# EAGLE schematic CntrlBoardV2_0 (EAGLE 7.7.0)

## Sheet 1 of 9: µC and Programming
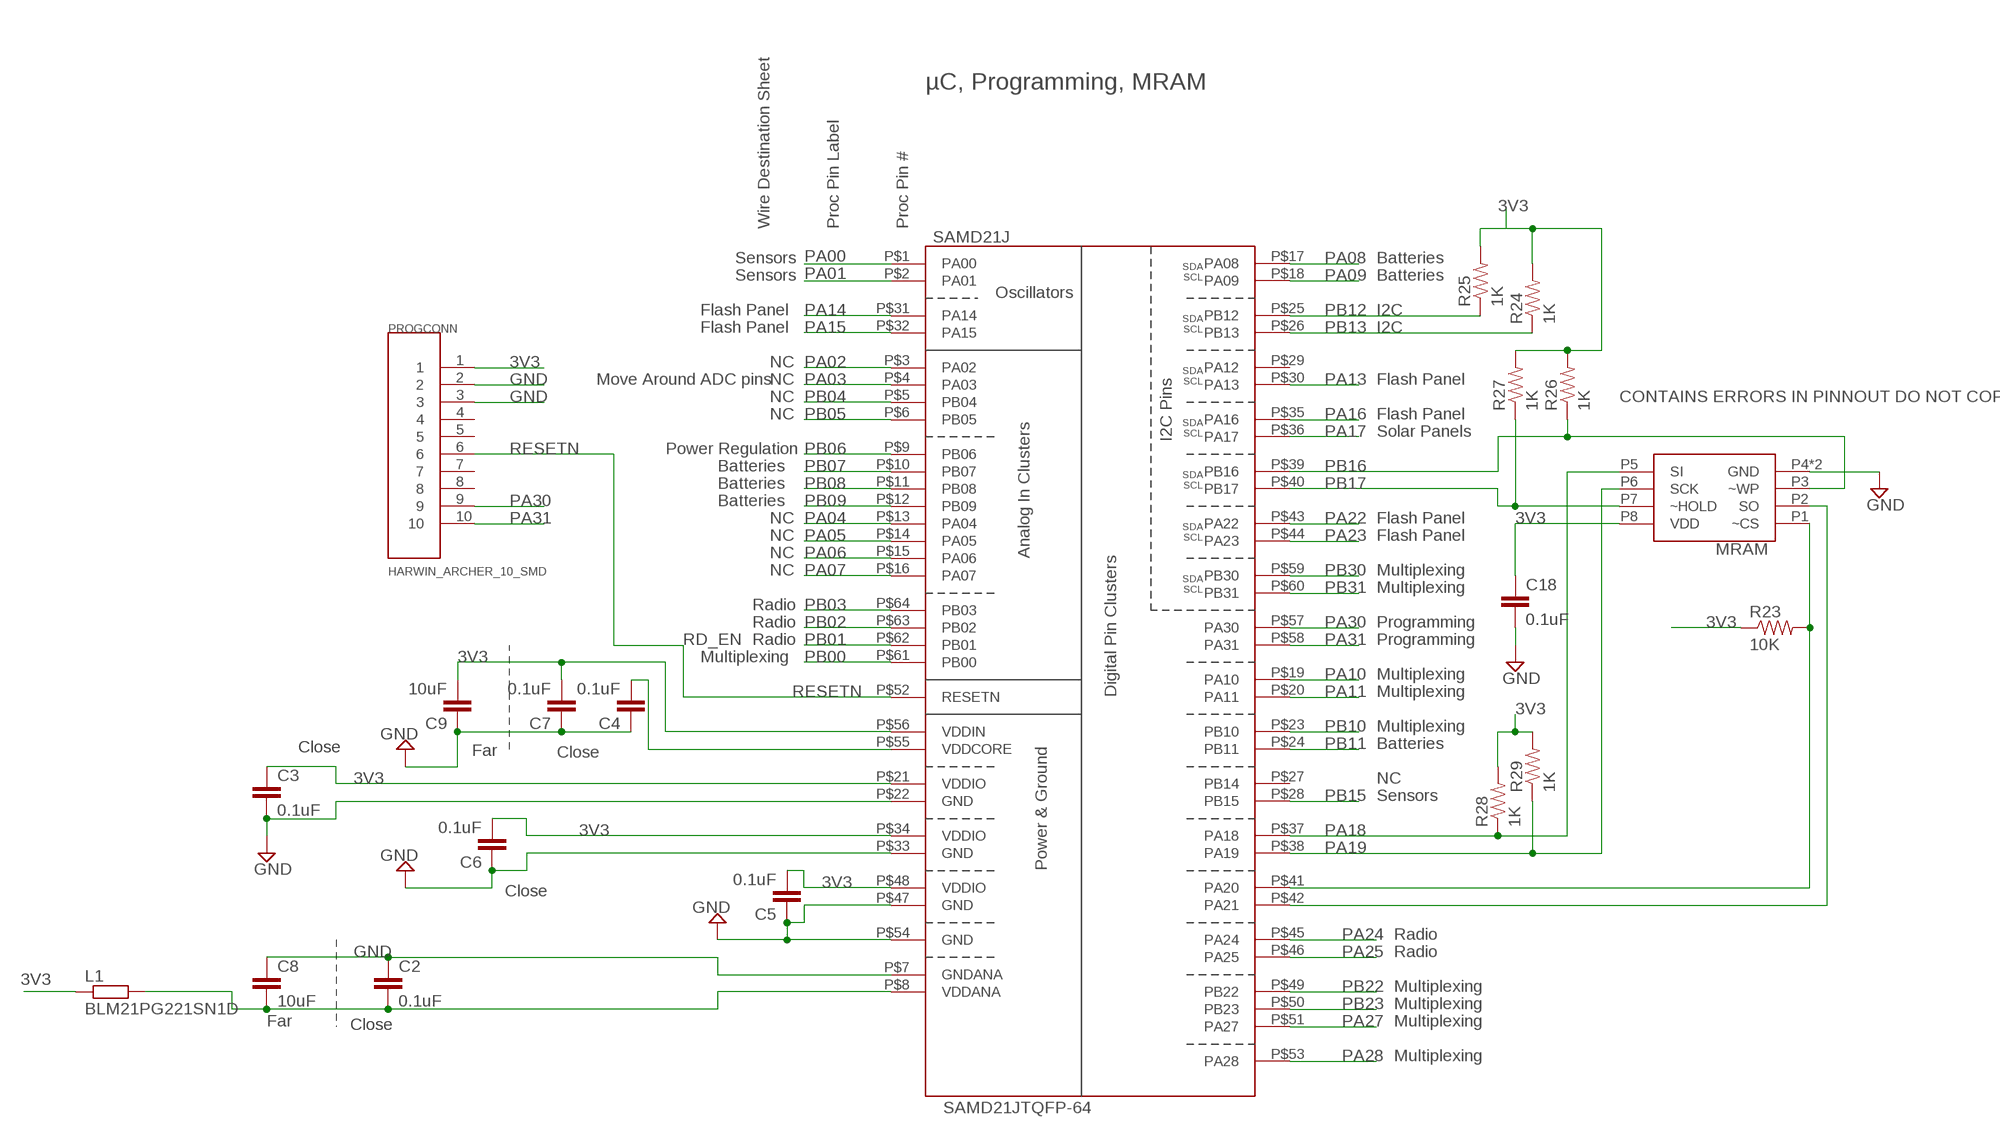
[diagram p0: schematic, sheet 1]

### Parts
C2  0.1uF  CAP0805  [0805]
C3  0.1uF  CAP0805  [0805]
C4  0.1uF  CAP0805  [0805]
C5  0.1uF  CAP0805  [0805]
C6  0.1uF  CAP0805  [0805]
C7  0.1uF  CAP0805  [0805]
C8  10uF  CAP0805  [0805]
C9  10uF  CAP0805  [0805]
C18  0.1uF  CAP0805  [0805]
L1  BLM21PG221SN1D  R-EU_R0805  [R0805]
MRAM  MR25H10CDC  [8PXMO-229]
PROGCONN  HARWIN_ARCHER_10_SMD  [HARWIN_ARCHER_10_SMD]
R23  10K  RESISTOR  [0805]
R24  1K  RESISTOR  [0805]
R25  1K  RESISTOR  [0805]
R26  1K  RESISTOR  [0805]
R27  1K  RESISTOR  [0805]
R28  1K  RESISTOR  [0805]
R29  1K  RESISTOR  [0805]
SAMD21J  SAMD21JTQFP-64  [TQFP-64]

### Nets
3V3 [3V3]: C3.1 C5.2 C6.2 C7.2 C9.2 C18.1 L1.1 MRAM.P8(VDD) PROGCONN.1 R23.1 R24.2 R25.2 R26.2 R27.2 R28.2 R29.2 SAMD21J.P$21(VDDIO) SAMD21J.P$34(VDDIO) SAMD21J.P$48(VDDIO) SAMD21J.P$56(VDDIN) ; also sheet 2,3,4,5,6,7,8
GND [GND]: C2.1 C3.2 C4.1 C5.1 C6.1 C7.1 C8.1 C9.1 C18.2 MRAM.P4(GND) MRAM.P9(GND) PROGCONN.2 PROGCONN.3 SAMD21J.P$7(GNDANA) SAMD21J.P$22(GND) SAMD21J.P$33(GND) SAMD21J.P$47(GND) SAMD21J.P$54(GND) ; also sheet 2,3,4,5,6,7,8,9
N$16: MRAM.P1(~CS) R23.2 SAMD21J.P$41(PA20)
N$18: MRAM.P2(SO) SAMD21J.P$42(PA21)
N$43: C2.2 C8.2 L1.2 SAMD21J.P$8(VDDANA)
N$44: C4.2 SAMD21J.P$55(VDDCORE)
PA00: SAMD21J.P$1(PA00) ; also sheet 3
PA01: SAMD21J.P$2(PA01)
PA02: SAMD21J.P$3(PA02)
PA03: SAMD21J.P$4(PA03)
PA04: SAMD21J.P$13(PA04)
PA05: SAMD21J.P$14(PA05)
PA06: SAMD21J.P$15(PA06)
PA07: SAMD21J.P$16(PA07)
PA08: SAMD21J.P$17(PA08) ; also sheet 5
PA09: SAMD21J.P$18(PA09) ; also sheet 5
PA10: SAMD21J.P$19(PA10) ; also sheet 7
PA11: SAMD21J.P$20(PA11) ; also sheet 7
PA13: SAMD21J.P$30(PA13) ; also sheet 8
PA14: SAMD21J.P$31(PA14) ; also sheet 8
PA15: SAMD21J.P$32(PA15) ; also sheet 8
PA16: SAMD21J.P$35(PA16) ; also sheet 8
PA17: SAMD21J.P$36(PA17) ; also sheet 6,9
PA18: MRAM.P5(SI) R28.1 SAMD21J.P$37(PA18)
PA19: MRAM.P6(SCK) R29.1 SAMD21J.P$38(PA19)
PA22: SAMD21J.P$43(PA22) ; also sheet 8
PA23: SAMD21J.P$44(PA23) ; also sheet 8
PA24: SAMD21J.P$45(PA24) ; also sheet 4
PA25: SAMD21J.P$46(PA25) ; also sheet 4
PA27: SAMD21J.P$51(PA27) ; also sheet 7
PA28: SAMD21J.P$53(PA28) ; also sheet 7
PA30: PROGCONN.9 SAMD21J.P$57(PA30) ; also sheet 9
PA31: PROGCONN.10 SAMD21J.P$58(PA31) ; also sheet 9
PB00: SAMD21J.P$61(PB00) ; also sheet 7
PB01: SAMD21J.P$62(PB01) ; also sheet 4
PB02: SAMD21J.P$63(PB02) ; also sheet 4
PB03: SAMD21J.P$64(PB03) ; also sheet 4
PB04: SAMD21J.P$5(PB04)
PB05: SAMD21J.P$6(PB05)
PB06: SAMD21J.P$9(PB06) ; also sheet 2
PB07: SAMD21J.P$10(PB07)
PB08: SAMD21J.P$11(PB08)
PB09: SAMD21J.P$12(PB09)
PB10: SAMD21J.P$23(PB10) ; also sheet 7
PB11: SAMD21J.P$24(PB11) ; also sheet 5
PB12: R25.1 SAMD21J.P$25(PB12) ; also sheet 3,6,8
PB13: R24.1 SAMD21J.P$26(PB13) ; also sheet 3,6,8
PB15: SAMD21J.P$28(PB15)
PB16: MRAM.P3(~WP) R26.1 SAMD21J.P$39(PB16)
PB17: MRAM.P7(~HOLD) R27.1 SAMD21J.P$40(PB17)
PB22: SAMD21J.P$49(PB22) ; also sheet 7
PB23: SAMD21J.P$50(PB23) ; also sheet 7
PB30: SAMD21J.P$59(PB30) ; also sheet 7
PB31: SAMD21J.P$60(PB31) ; also sheet 7
RESETN: PROGCONN.6 SAMD21J.P$52(RESETN) ; also sheet 9
Unconnected: PROGCONN.4 PROGCONN.5 PROGCONN.7 PROGCONN.8 SAMD21J.P$27(PB14) SAMD21J.P$29(PA12)

### Notes on the sheet
- µC, Programming, MRAM
- Wire Destination Sheet | Proc Pin Label | Proc Pin #
- Sensors | Batteries
- Sensors | Batteries
- Flash Panel | I2C
- Flash Panel | I2C
- NC
- Move Around ADC pins | NC | Flash Panel
- NC | CONTAINS ERRORS IN PINNOUT DO NOT COPY
- NC | Flash Panel
- Solar Panels
- Power Regulation
- Batteries
- Batteries
- Batteries
- NC | Flash Panel
- NC | Flash Panel
- NC
- NC | Multiplexing
- Multiplexing
- Radio
- Radio | Programming
- RD_EN | Radio | Programming
- Multiplexing
- Multiplexing
- Multiplexing
- Multiplexing
- Far | Close
- Close | Batteries
- NC
- Sensors
- Close
- Radio
- Radio
- Multiplexing
- Multiplexing
- Far | Close | Multiplexing
- Multiplexing

## Sheet 2 of 9: Power Regulation
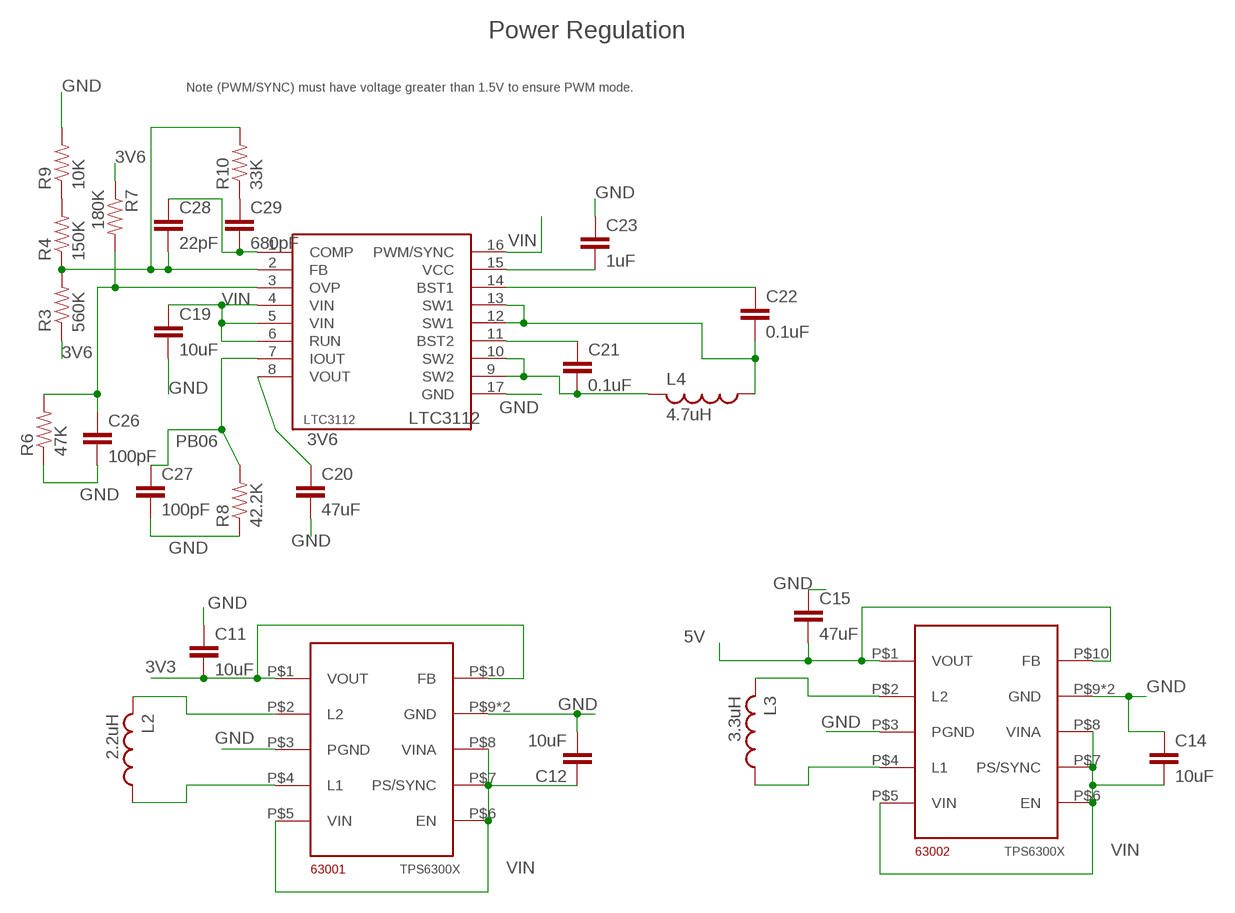
[diagram p1: schematic, sheet 2]

### Parts
63001  TPS6300X  [QFN10_POWERPAD]
63002  TPS6300X  [QFN10_POWERPAD]
C11  10uF  CAP0603-CAP  [0603-CAP]
C12  10uF  CAP0603-CAP  [0603-CAP]
C14  10uF  CAP0603-CAP  [0603-CAP]
C15  47uF  CAP0603-CAP  [0603-CAP]
C19  10uF  CAP0603-CAP  [0603-CAP]
C20  47uF  CAP0805  [0805]
C21  0.1uF  CAP0603-CAP  [0603-CAP]
C22  0.1uF  CAP0603-CAP  [0603-CAP]
C23  1uF  CAP0603-CAP  [0603-CAP]
C26  100pF  CAP0805  [0805]
C27  100pF  CAP0805  [0805]
C28  22pF  CAP0805  [0805]
C29  680pF  CAP0805  [0805]
L2  2.2uH  L-USL3225M  [L3225M]
L3  3.3uH  L-USL3225M  [L3225M]
L4  4.7uH  L-USL3225M  [L3225M]
LTC3112  LTC3112  [DHD16]
R3  560K  RESISTOR  [0805]
R4  150K  RESISTOR  [0805]
R6  47K  RESISTOR  [0805]
R7  180K  RESISTOR  [0805]
R8  42.2K  RESISTOR  [0805]
R9  10K  RESISTOR  [0805]
R10  33K  RESISTOR  [0805]

### Nets
3V3 [3V3]: 63001.P$1(VOUT) 63001.P$10(FB) C11.2 ; also sheet 1,3,4,5,6,7,8
3V6 [3V6]: C20.1 LTC3112.8(VOUT) R3.1 R7.1 ; also sheet 4
5V [5V]: 63002.P$1(VOUT) 63002.P$10(FB) C15.2 ; also sheet 3,5,7,8
GND [GND]: 63001.P$3(PGND) 63001.P$9(GND) 63001.PAD(GND) 63002.P$3(PGND) 63002.P$9(GND) 63002.PAD(GND) C11.1 C12.2 C14.1 C15.1 C19.2 C20.2 C23.1 C26.2 C27.2 LTC3112.17(GND) R6.1 R8.1 R9.2 ; also sheet 1,3,4,5,6,7,8,9
N$3: C21.1 LTC3112.11(BST2)
N$4: C22.1 LTC3112.14(BST1)
N$5: C23.2 LTC3112.15(VCC)
N$40: C22.2 L4.1 LTC3112.12(SW1) LTC3112.13(SW1)
N$45: 63002.P$2(L2) L3.2
N$46: 63002.P$4(L1) L3.1
N$48: 63001.P$2(L2) L2.2
N$50: 63001.P$4(L1) L2.1
N$53: C21.2 L4.2 LTC3112.9(SW2) LTC3112.10(SW2)
N$54: C28.2 LTC3112.2(FB) R3.2 R4.1 R10.2
N$69: C26.1 LTC3112.3(OVP) R6.2 R7.2
N$70: C29.1 R10.1
N$71: C28.1 C29.2 LTC3112.1(COMP)
N$999: R4.2 R9.1
PB06: C27.1 LTC3112.7(IOUT) R8.2 ; also sheet 1
VIN: 63001.P$5(VIN) 63001.P$6(EN) 63001.P$7(PS/SYNC) 63001.P$8(VINA) 63002.P$5(VIN) 63002.P$6(EN) 63002.P$7(PS/SYNC) 63002.P$8(VINA) C12.1 C14.2 C19.1 LTC3112.4(VIN) LTC3112.5(VIN) LTC3112.6(RUN) LTC3112.16(PWM/SYNC) ; also sheet 5,7

### Notes on the sheet
- Power Regulation
- Note (PWM/SYNC) must have voltage greater than 1.5V to ensure PWM mode.

## Sheet 3 of 9: Sensors
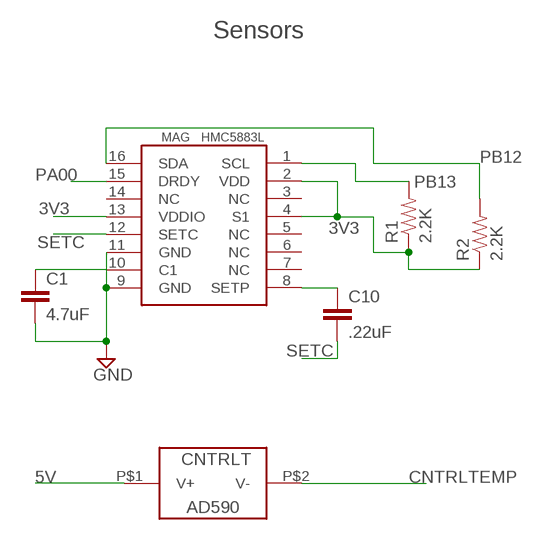
[diagram p2: schematic, sheet 3]

### Parts
C1  4.7uF  CAP0805  [0805]
C10  .22uF  CAP0805  [0805]
CNTRLT  AD590-TH  [AD590TH]
MAG  HMC5883L  [HMC5883L]
R1  2.2K  RESISTOR  [0805]
R2  2.2K  RESISTOR  [0805]

### Nets
3V3 [3V3]: MAG.2(VDD) MAG.4(S1) MAG.13(VDDIO) R1.1 R2.1 ; also sheet 1,2,4,5,6,7,8
5V [5V]: CNTRLT.P$1(V+) ; also sheet 2,5,7,8
CNTRLTEMP: CNTRLT.P$2(V-) ; also sheet 7
GND [GND]: C1.2 MAG.9(GND) MAG.11(GND) ; also sheet 1,2,4,5,6,7,8,9
N$1: C1.1 MAG.10(C1)
N$36: C10.1 MAG.8(SETP)
PA00: MAG.15(DRDY) ; also sheet 1
PB12: MAG.16(SDA) R2.2 ; also sheet 1,6,8
PB13: MAG.1(SCL) R1.2 ; also sheet 1,6,8
SETC: C10.2 MAG.12(SETC)
Unconnected: MAG.3(NC) MAG.5(NC) MAG.6(NC) MAG.7(NC) MAG.14(NC)

### Notes on the sheet
- Sensors

## Sheet 4 of 9: Radio
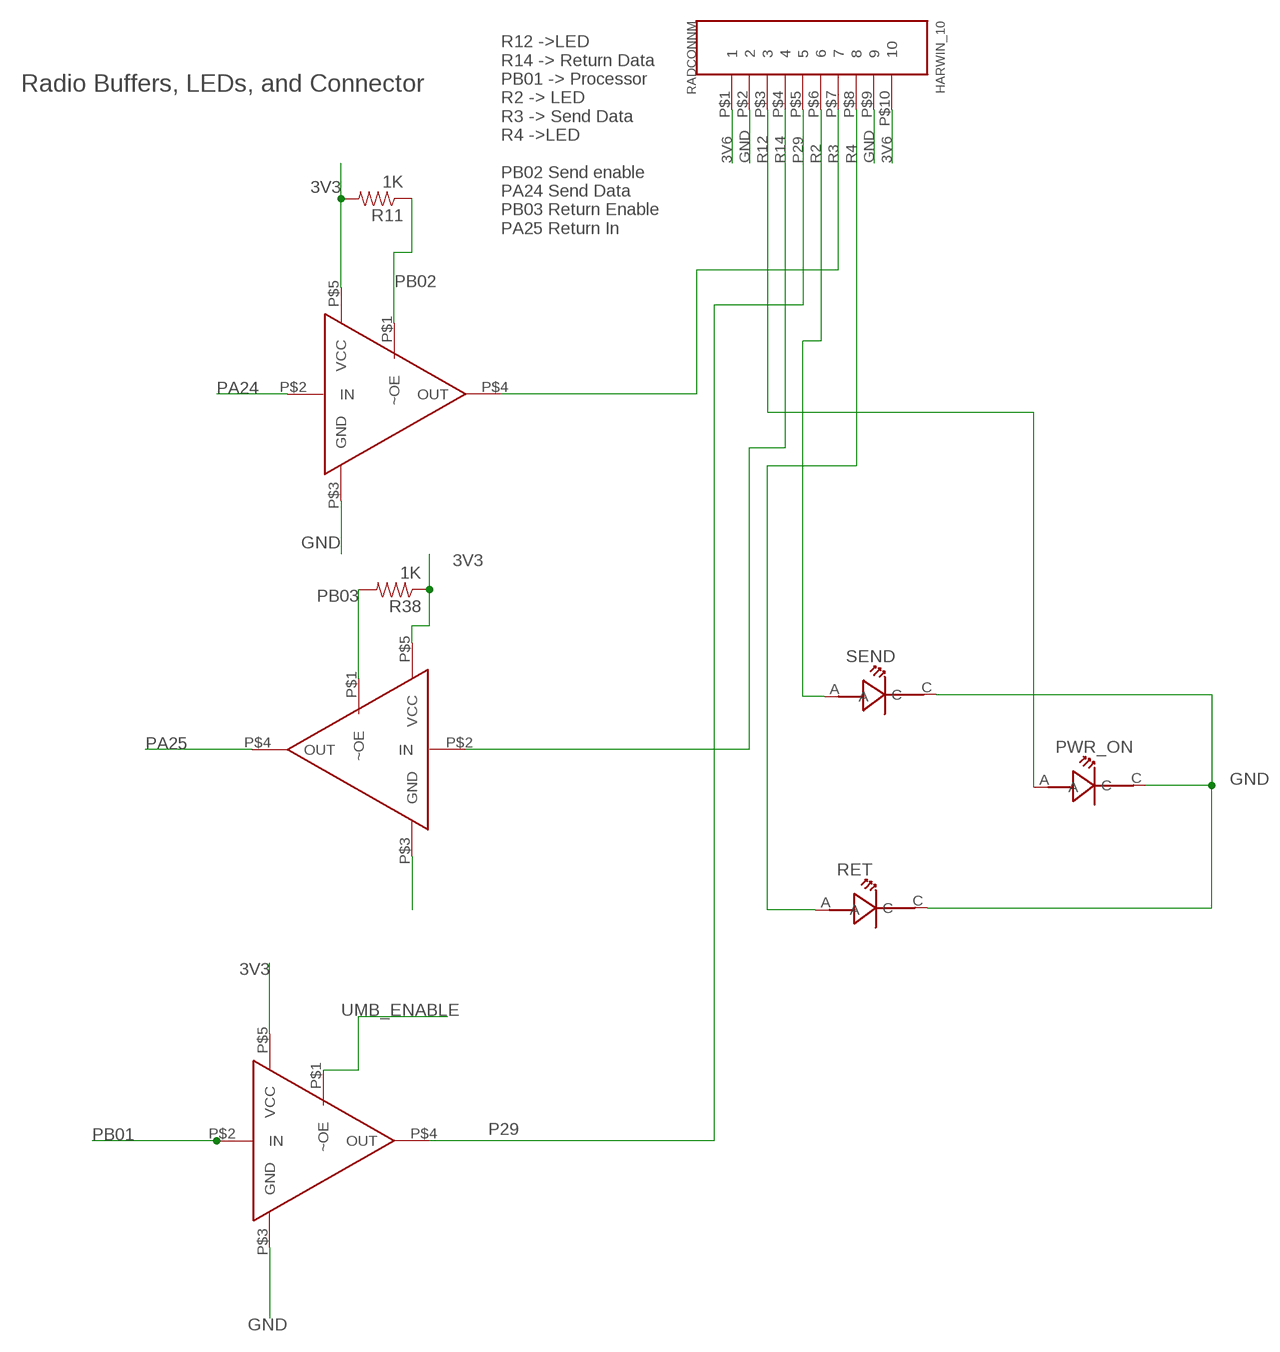
[diagram p3: schematic, sheet 4]

### Parts
PWR_ON  LT-T673-Q1R2-25-Z  [PLCC-2]
R11  1K  RESISTOR  [0805]
R38  1K  RESISTOR  [0805]
RAD_SHDN_BUF  SN74LVC1G125  [SC70]
RADCONNM  HARWIN_10  [HARWIN_DATAMATE_10]
RET  LT-T673-Q1R2-25-Z  [PLCC-2]
RX_BUF  SN74LVC1G125  [SC70]
SEND  LT-T673-Q1R2-25-Z  [PLCC-2]
TX_BUF  SN74LVC1G125  [SC70]

### Nets
3V3 [3V3]: R11.2 R38.1 RAD_SHDN_BUF.P$5(VCC) RX_BUF.P$5(VCC) TX_BUF.P$5(VCC) ; also sheet 1,2,3,5,6,7,8
3V6 [3V6]: RADCONNM.P$1 RADCONNM.P$10 ; also sheet 2
GND [GND]: PWR_ON.C RAD_SHDN_BUF.P$3(GND) RADCONNM.P$2 RADCONNM.P$9 RET.C RX_BUF.P$3(GND) SEND.C TX_BUF.P$3(GND) ; also sheet 1,2,3,5,6,7,8,9
P29: RAD_SHDN_BUF.P$4(OUT) RADCONNM.P$5 ; also sheet 9
PA24: TX_BUF.P$2(IN) ; also sheet 1
PA25: RX_BUF.P$4(OUT) ; also sheet 1
PB01: RAD_SHDN_BUF.P$2(IN) ; also sheet 1
PB02: R11.1 TX_BUF.P$1(~OE) ; also sheet 1
PB03: R38.2 RX_BUF.P$1(~OE) ; also sheet 1
R2: RADCONNM.P$6 SEND.A ; also sheet 9
R3: RADCONNM.P$7 TX_BUF.P$4(OUT) ; also sheet 9
R4: RADCONNM.P$8 RET.A ; also sheet 9
R12: PWR_ON.A RADCONNM.P$3 ; also sheet 9
R14: RADCONNM.P$4 RX_BUF.P$2(IN) ; also sheet 9
UMB_ENABLE: RAD_SHDN_BUF.P$1(~OE) ; also sheet 5,8,9

### Notes on the sheet
- Radio Buffers, LEDs, and Connector
- R12 ->LED
  R14 -> Return Data
  PB01 -> Processor
  R2 -> LED
  R3 -> Send Data
  R4 ->LED
  
  PB02 Send enable
  PA24 Send Data
  PB03 Return Enable
  PA25 Return In

## Sheet 5 of 9: Batteries
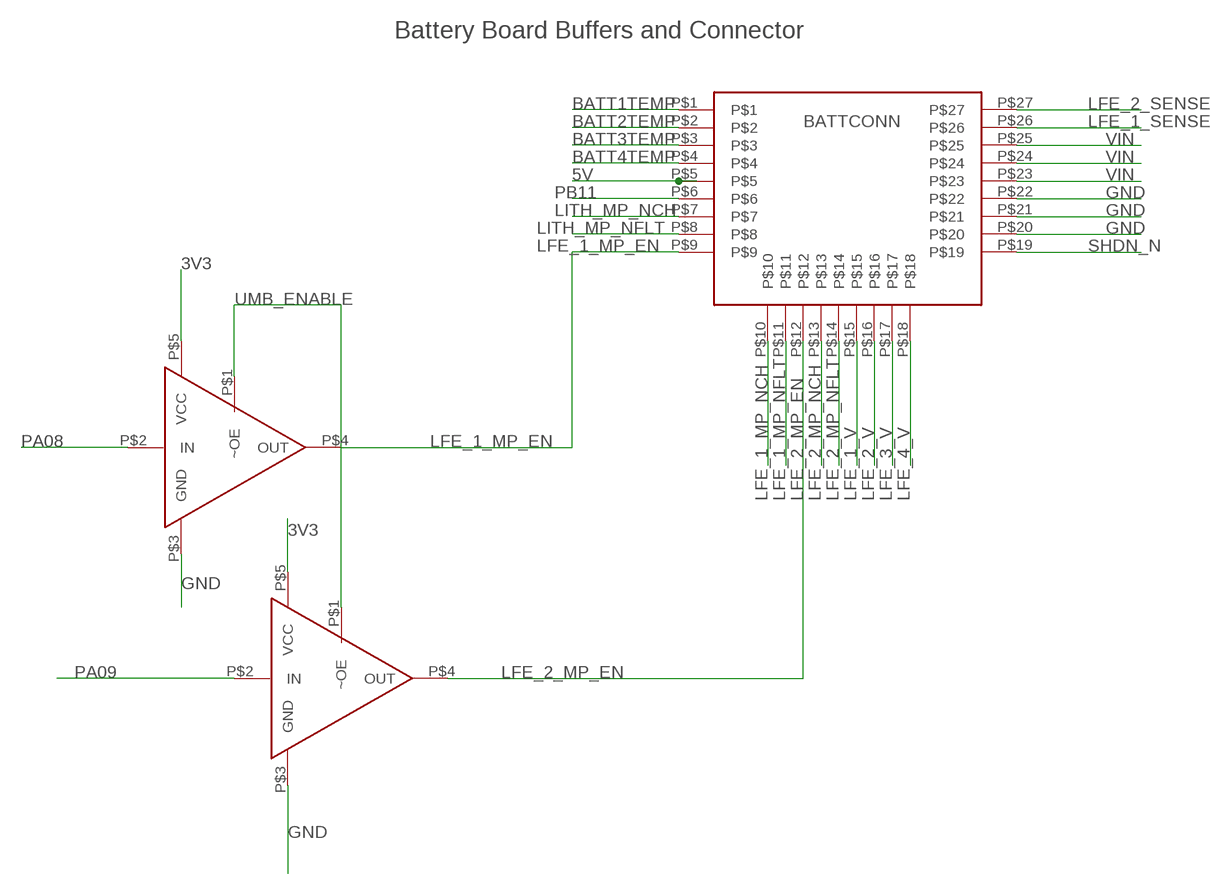
[diagram p4: schematic, sheet 5]

### Parts
BAL_1_BUF  SN74LVC1G125  [SC70]
BAL_2_BUF  SN74LVC1G125  [SC70]
BATTCONN  HARWIN_27  [HARWIN_DATAMATE_27]

### Nets
3V3 [3V3]: BAL_1_BUF.P$5(VCC) BAL_2_BUF.P$5(VCC) ; also sheet 1,2,3,4,6,7,8
5V [5V]: BATTCONN.P$5 ; also sheet 2,3,7,8
BATT1TEMP: BATTCONN.P$1 ; also sheet 7
BATT2TEMP: BATTCONN.P$2 ; also sheet 7
BATT3TEMP: BATTCONN.P$3 ; also sheet 7
BATT4TEMP: BATTCONN.P$4 ; also sheet 7
GND [GND]: BAL_1_BUF.P$3(GND) BAL_2_BUF.P$3(GND) BATTCONN.P$20 BATTCONN.P$21 BATTCONN.P$22 ; also sheet 1,2,3,4,6,7,8,9
LFE_1_MP_EN: BAL_1_BUF.P$4(OUT) BATTCONN.P$9
LFE_1_MP_NCH: BATTCONN.P$10 ; also sheet 7
LFE_1_MP_NFLT: BATTCONN.P$11 ; also sheet 7
LFE_1_SENSE: BATTCONN.P$26 ; also sheet 7
LFE_1_V: BATTCONN.P$15 ; also sheet 7
LFE_2_MP_EN: BAL_2_BUF.P$4(OUT) BATTCONN.P$12
LFE_2_MP_NCH: BATTCONN.P$13 ; also sheet 7
LFE_2_MP_NFLT: BATTCONN.P$14 ; also sheet 7
LFE_2_SENSE: BATTCONN.P$27 ; also sheet 7
LFE_2_V: BATTCONN.P$16 ; also sheet 7
LFE_3_V: BATTCONN.P$17 ; also sheet 7
LFE_4_V: BATTCONN.P$18 ; also sheet 7
LITH_MP_NCH: BATTCONN.P$7 ; also sheet 7
LITH_MP_NFLT: BATTCONN.P$8 ; also sheet 7
PA08: BAL_1_BUF.P$2(IN) ; also sheet 1
PA09: BAL_2_BUF.P$2(IN) ; also sheet 1
PB11: BATTCONN.P$6 ; also sheet 1
SHDN_N: BATTCONN.P$19 ; also sheet 8,9
UMB_ENABLE: BAL_1_BUF.P$1(~OE) BAL_2_BUF.P$1(~OE) ; also sheet 4,8,9
VIN: BATTCONN.P$23 BATTCONN.P$24 BATTCONN.P$25 ; also sheet 2,7

### Notes on the sheet
- Battery Board Buffers and Connector

## Sheet 6 of 9: Solar Panels
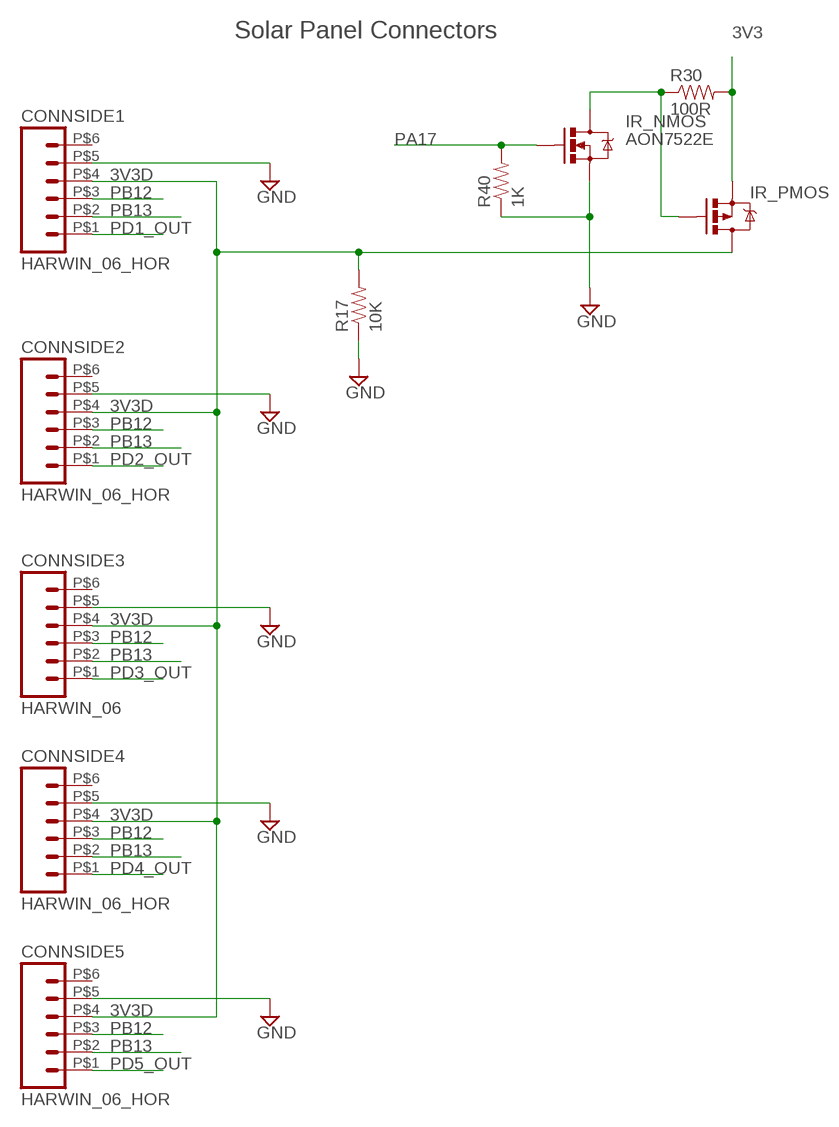
[diagram p5: schematic, sheet 6]

### Parts
CONNSIDE1  HARWIN_06_HOR  [HARWIN_DATAMATE_6_HOR]
CONNSIDE2  HARWIN_06_HOR  [HARWIN_DATAMATE_6_HOR]
CONNSIDE3  HARWIN_06  [HARWIN_DATAMATE_6]
CONNSIDE4  HARWIN_06_HOR  [HARWIN_DATAMATE_6_HOR]
CONNSIDE5  HARWIN_06_HOR  [HARWIN_DATAMATE_6_HOR]
IR_NMOS  AON7522E  [DFN3]
IR_PMOS  POWERPMOS  [SO08]
R17  10K  RESISTOR  [0805]
R30  100R  RESISTOR  [0805]
R40  1K  RESISTOR  [0805]

### Nets
3V3 [3V3]: IR_PMOS.1(S) IR_PMOS.2(S) IR_PMOS.3(S) R30.2 ; also sheet 1,2,3,4,5,7,8
3V3D [3V3]: CONNSIDE1.P$4 CONNSIDE2.P$4 CONNSIDE3.P$4 CONNSIDE4.P$4 CONNSIDE5.P$4 IR_PMOS.5(D) IR_PMOS.6(D) IR_PMOS.7(D) IR_PMOS.8(D) R17.2 ; also sheet 8
GND [GND]: CONNSIDE1.P$5 CONNSIDE2.P$5 CONNSIDE3.P$5 CONNSIDE4.P$5 CONNSIDE5.P$5 IR_NMOS.P$1(S) IR_NMOS.P$2(S) IR_NMOS.P$3(S) R17.1 R40.1 ; also sheet 1,2,3,4,5,7,8,9
IR_PW_MID: IR_NMOS.P$5(D) IR_NMOS.P$6(D) IR_NMOS.P$7(D) IR_NMOS.P$8(D) IR_NMOS.P$9(D) IR_PMOS.4(G) R30.1
PA17: IR_NMOS.P$4(G) R40.2 ; also sheet 1,9
PB12: CONNSIDE1.P$3 CONNSIDE2.P$3 CONNSIDE3.P$3 CONNSIDE4.P$3 CONNSIDE5.P$3 ; also sheet 1,3,8
PB13: CONNSIDE1.P$2 CONNSIDE2.P$2 CONNSIDE3.P$2 CONNSIDE4.P$2 CONNSIDE5.P$2 ; also sheet 1,3,8
PD1_OUT: CONNSIDE1.P$1 ; also sheet 7
PD2_OUT: CONNSIDE2.P$1 ; also sheet 7
PD3_OUT: CONNSIDE3.P$1 ; also sheet 7
PD4_OUT: CONNSIDE4.P$1 ; also sheet 7
PD5_OUT: CONNSIDE5.P$1 ; also sheet 7
Unconnected: CONNSIDE1.P$6 CONNSIDE2.P$6 CONNSIDE3.P$6 CONNSIDE4.P$6 CONNSIDE5.P$6

### Notes on the sheet
- Solar Panel Connectors
- IR_PMOS

## Sheet 7 of 9: Multiplexing
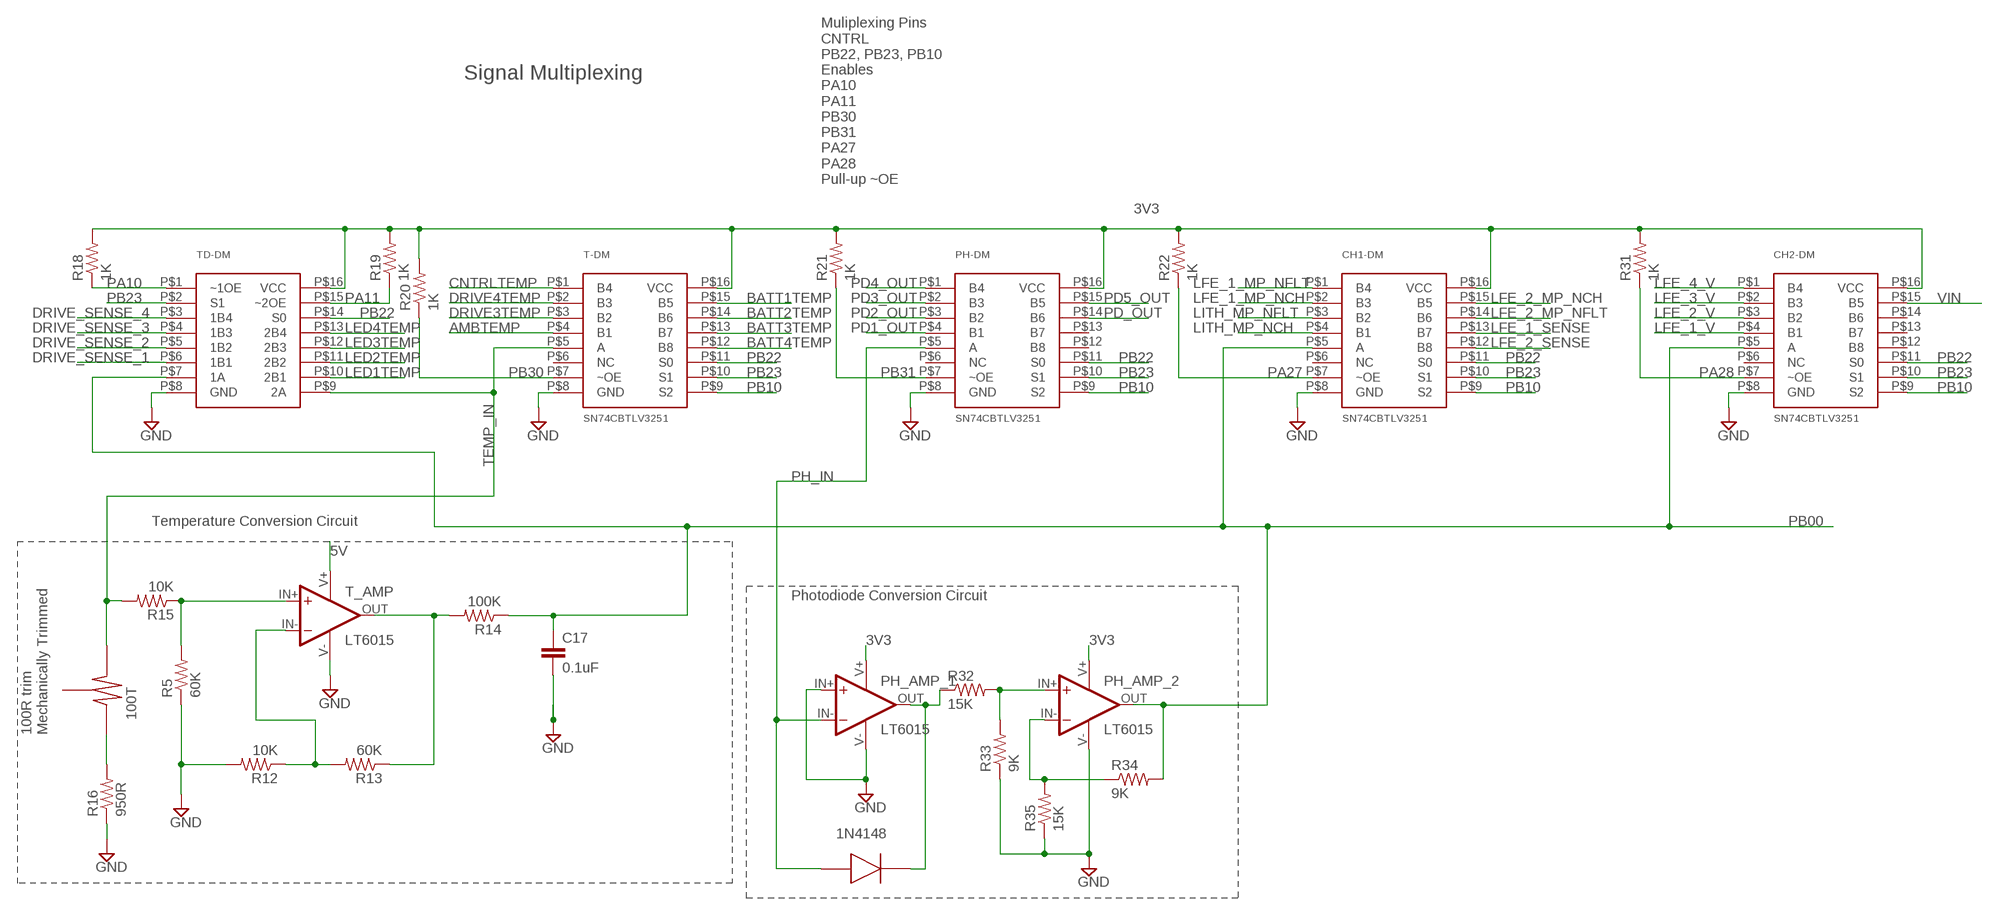
[diagram p6: schematic, sheet 7]

### Parts
1N4148  1N4148WS  [SOD-323F]
100T  TRIMPOT-TC33  [TC33X-2]
C17  0.1uF  CAP0805  [0805]
CH1-DM  SN74CBTLV3251  [TSSOP-16]
CH2-DM  SN74CBTLV3251  [TSSOP-16]
PH-DM  SN74CBTLV3251  [TSSOP-16]
PH_AMP_1  LT6015  [SOT23-5]
PH_AMP_2  LT6015  [SOT23-5]
R5  60K  RESISTOR  [0805]
R12  10K  RESISTOR  [0805]
R13  60K  RESISTOR  [0805]
R14  100K  RESISTOR  [0805]
R15  10K  RESISTOR  [0805]
R16  950R  RESISTOR  [0805]
R18  1K  RESISTOR  [0805]
R19  1K  RESISTOR  [0805]
R20  1K  RESISTOR  [0805]
R21  1K  RESISTOR  [0805]
R22  1K  RESISTOR  [0805]
R31  1K  RESISTOR  [0805]
R32  15K  RESISTOR  [0805]
R33  9K  RESISTOR  [0805]
R34  9K  RESISTOR  [0805]
R35  15K  RESISTOR  [0805]
T-DM  SN74CBTLV3251  [TSSOP-16]
T_AMP  LT6015  [SOT23-5]
TD-DM  SN74CBTLV3253  [TSSOP-16]

### Nets
3V3 [3V3]: CH1-DM.P$16(VCC) CH2-DM.P$16(VCC) PH-DM.P$16(VCC) PH_AMP_1.V+ PH_AMP_2.V+ R18.2 R19.2 R20.2 R21.2 R22.2 R31.2 T-DM.P$16(VCC) TD-DM.P$16(VCC) ; also sheet 1,2,3,4,5,6,8
5V [5V]: T_AMP.V+ ; also sheet 2,3,5,8
AMBTEMP: T-DM.P$4(B1) ; also sheet 8
BATT1TEMP: T-DM.P$15(B5) ; also sheet 5
BATT2TEMP: T-DM.P$14(B6) ; also sheet 5
BATT3TEMP: T-DM.P$13(B7) ; also sheet 5
BATT4TEMP: T-DM.P$12(B8) ; also sheet 5
CNTRLTEMP: T-DM.P$1(B4) ; also sheet 3
DRIVE3TEMP: T-DM.P$3(B2) ; also sheet 8
DRIVE4TEMP: T-DM.P$2(B3) ; also sheet 8
DRIVE_SENSE_1: TD-DM.P$6(1B1) ; also sheet 8
DRIVE_SENSE_2: TD-DM.P$5(1B2) ; also sheet 8
DRIVE_SENSE_3: TD-DM.P$4(1B3) ; also sheet 8
DRIVE_SENSE_4: TD-DM.P$3(1B4) ; also sheet 8
GND [GND]: C17.2 CH1-DM.P$8(GND) CH2-DM.P$8(GND) PH-DM.P$8(GND) PH_AMP_1.IN+ PH_AMP_1.V- PH_AMP_2.V- R5.1 R12.2 R16.1 R33.1 R35.1 T-DM.P$8(GND) T_AMP.V- TD-DM.P$8(GND) ; also sheet 1,2,3,4,5,6,8,9
LED1TEMP: TD-DM.P$10(2B1) ; also sheet 8
LED2TEMP: TD-DM.P$11(2B2) ; also sheet 8
LED3TEMP: TD-DM.P$12(2B3) ; also sheet 8
LED4TEMP: TD-DM.P$13(2B4) ; also sheet 8
LFE_1_MP_NCH: CH1-DM.P$2(B3) ; also sheet 5
LFE_1_MP_NFLT: CH1-DM.P$1(B4) ; also sheet 5
LFE_1_SENSE: CH1-DM.P$13(B7) ; also sheet 5
LFE_1_V: CH2-DM.P$4(B1) ; also sheet 5
LFE_2_MP_NCH: CH1-DM.P$15(B5) ; also sheet 5
LFE_2_MP_NFLT: CH1-DM.P$14(B6) ; also sheet 5
LFE_2_SENSE: CH1-DM.P$12(B8) ; also sheet 5
LFE_2_V: CH2-DM.P$3(B2) ; also sheet 5
LFE_3_V: CH2-DM.P$2(B3) ; also sheet 5
LFE_4_V: CH2-DM.P$1(B4) ; also sheet 5
LITH_MP_NCH: CH1-DM.P$4(B1) ; also sheet 5
LITH_MP_NFLT: CH1-DM.P$3(B2) ; also sheet 5
N$2 [GND]: R5.2 R15.1 T_AMP.IN+
N$6: R13.1 R14.2 T_AMP.OUT
N$7: R12.1 R13.2 T_AMP.IN-
N$8: 100T.P$1 R16.2
N$15: PH_AMP_2.IN+ R32.2 R33.2
N$17: 1N4148.CATHODE PH_AMP_1.OUT R32.1
N$19: PH_AMP_2.IN- R34.1 R35.2
PA10: R18.1 TD-DM.P$1(~1OE) ; also sheet 1
PA11: R19.1 TD-DM.P$15(~2OE) ; also sheet 1
PA27: CH1-DM.P$7(~OE) R22.1 ; also sheet 1
PA28: CH2-DM.P$7(~OE) R31.1 ; also sheet 1
PB00: C17.1 CH1-DM.P$5(A) CH2-DM.P$5(A) PH_AMP_2.OUT R14.1 R34.2 TD-DM.P$7(1A) ; also sheet 1
PB10: CH1-DM.P$9(S2) CH2-DM.P$9(S2) PH-DM.P$9(S2) T-DM.P$9(S2) ; also sheet 1
PB22: CH1-DM.P$11(S0) CH2-DM.P$11(S0) PH-DM.P$11(S0) T-DM.P$11(S0) TD-DM.P$14(S0) ; also sheet 1
PB23: CH1-DM.P$10(S1) CH2-DM.P$10(S1) PH-DM.P$10(S1) T-DM.P$10(S1) TD-DM.P$2(S1) ; also sheet 1
PB30: R20.1 T-DM.P$7(~OE) ; also sheet 1
PB31: PH-DM.P$7(~OE) R21.1 ; also sheet 1
PD1_OUT: PH-DM.P$4(B1) ; also sheet 6
PD2_OUT: PH-DM.P$3(B2) ; also sheet 6
PD3_OUT: PH-DM.P$2(B3) ; also sheet 6
PD4_OUT: PH-DM.P$1(B4) ; also sheet 6
PD5_OUT: PH-DM.P$15(B5) ; also sheet 6
PD_OUT: PH-DM.P$14(B6) ; also sheet 8
PH_IN: 1N4148.ANODE PH-DM.P$5(A) PH_AMP_1.IN-
TEMP_IN: 100T.P$3 R15.2 T-DM.P$5(A) TD-DM.P$9(2A)
VIN: CH2-DM.P$15(B5) ; also sheet 2,5
Unconnected: 100T.P$2 CH1-DM.P$6(NC) CH2-DM.P$6(NC) CH2-DM.P$12(B8) CH2-DM.P$13(B7) CH2-DM.P$14(B6) PH-DM.P$6(NC) PH-DM.P$12(B8) PH-DM.P$13(B7) T-DM.P$6(NC)

### Notes on the sheet
- Signal Multiplexing
- Muliplexing Pins
  CNTRL
  PB22, PB23, PB10
  Enables
  PA10
  PA11
  PB30
  PB31
  PA27
  PA28
  Pull-up ~OE
- Temperature Conversion Circuit
- Photodiode Conversion Circuit
- 100R trim
  Mechanically Trimmed

## Sheet 8 of 9: Flash Panel
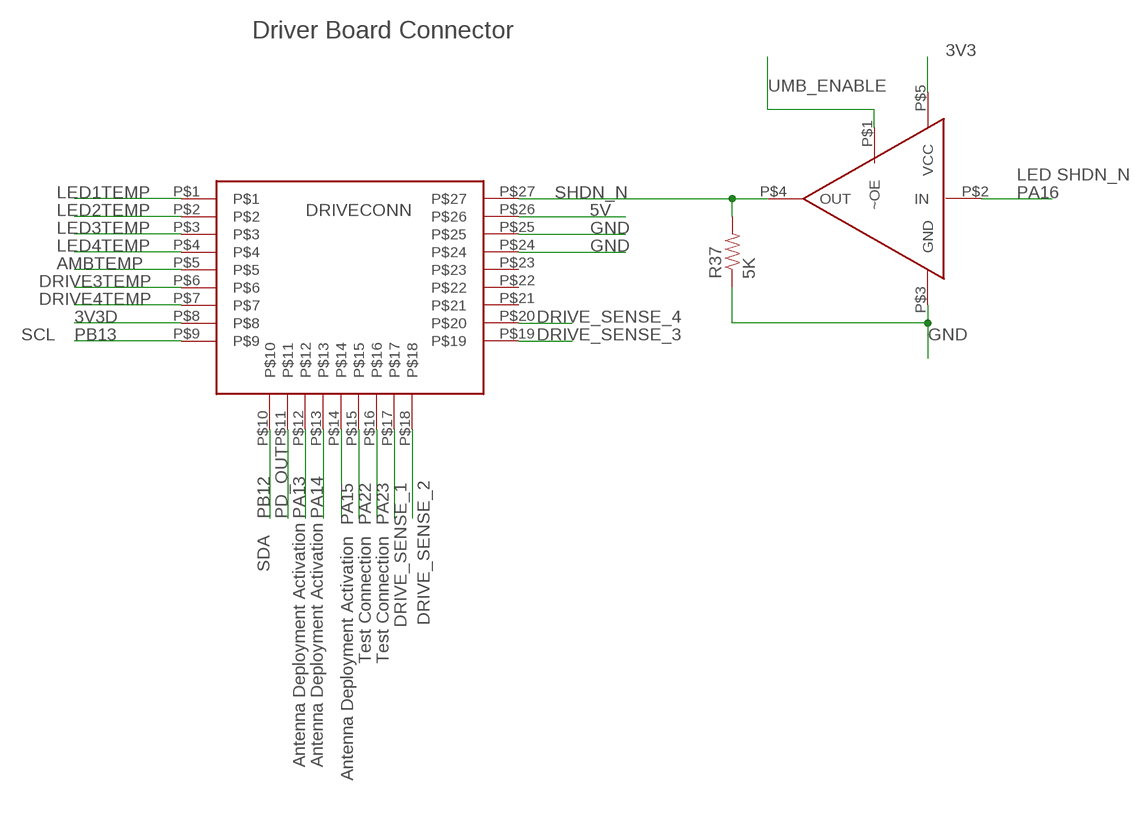
[diagram p7: schematic, sheet 8]

### Parts
DRIVECONN  HARWIN_27_HOR  [HARWIN_DATAMATE_27_HOR]
LED_EN_BUF  SN74LVC1G125  [SC70]
R37  5K  RESISTOR  [0805]

### Nets
3V3 [3V3]: LED_EN_BUF.P$5(VCC) ; also sheet 1,2,3,4,5,6,7
3V3D [3V3]: DRIVECONN.P$8 ; also sheet 6
5V [5V]: DRIVECONN.P$26 ; also sheet 2,3,5,7
AMBTEMP: DRIVECONN.P$5 ; also sheet 7
DRIVE3TEMP: DRIVECONN.P$6 ; also sheet 7
DRIVE4TEMP: DRIVECONN.P$7 ; also sheet 7
DRIVE_SENSE_1: DRIVECONN.P$17 ; also sheet 7
DRIVE_SENSE_2: DRIVECONN.P$18 ; also sheet 7
DRIVE_SENSE_3: DRIVECONN.P$19 ; also sheet 7
DRIVE_SENSE_4: DRIVECONN.P$20 ; also sheet 7
GND [GND]: DRIVECONN.P$24 DRIVECONN.P$25 LED_EN_BUF.P$3(GND) R37.1 ; also sheet 1,2,3,4,5,6,7,9
LED1TEMP: DRIVECONN.P$1 ; also sheet 7
LED2TEMP: DRIVECONN.P$2 ; also sheet 7
LED3TEMP: DRIVECONN.P$3 ; also sheet 7
LED4TEMP: DRIVECONN.P$4 ; also sheet 7
PA13: DRIVECONN.P$12 ; also sheet 1
PA14: DRIVECONN.P$13 ; also sheet 1
PA15: DRIVECONN.P$14 ; also sheet 1
PA16: LED_EN_BUF.P$2(IN) ; also sheet 1
PA22: DRIVECONN.P$15 ; also sheet 1
PA23: DRIVECONN.P$16 ; also sheet 1
PB12: DRIVECONN.P$10 ; also sheet 1,3,6
PB13: DRIVECONN.P$9 ; also sheet 1,3,6
PD_OUT: DRIVECONN.P$11 ; also sheet 7
SHDN_N: DRIVECONN.P$27 LED_EN_BUF.P$4(OUT) R37.2 ; also sheet 5,9
UMB_ENABLE: LED_EN_BUF.P$1(~OE) ; also sheet 4,5,9
Unconnected: DRIVECONN.P$21 DRIVECONN.P$22 DRIVECONN.P$23

### Notes on the sheet
- Driver Board Connector
- LED SHDN_N
- SCL
- Antenna Deployment Activation | Test Connection | Test Connection
- SDA
- Antenna Deployment Activation | Antenna Deployment Activation

## Sheet 9 of 9: Umbilical
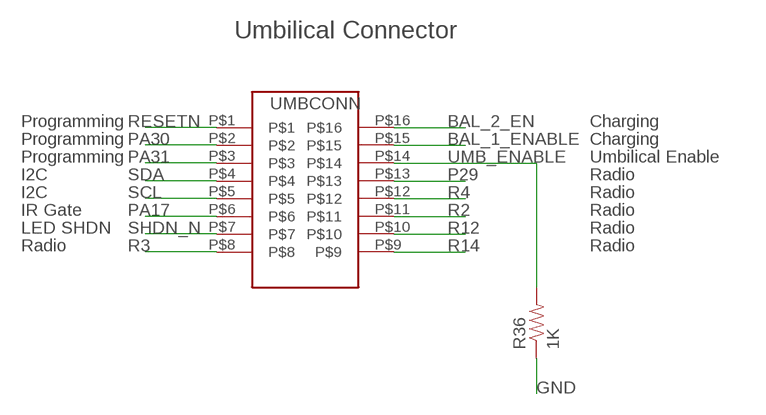
[diagram p8: schematic, sheet 9]

### Parts
R36  1K  RESISTOR  [0805]
UMBCONN  HARWIN_16  [HARWIN_DATAMATE_16]

### Nets
BAL_1_ENABLE: UMBCONN.P$15
BAL_2_EN: UMBCONN.P$16
GND [GND]: R36.1 ; also sheet 1,2,3,4,5,6,7,8
P29: UMBCONN.P$13 ; also sheet 4
PA17: UMBCONN.P$6 ; also sheet 1,6
PA30: UMBCONN.P$2 ; also sheet 1
PA31: UMBCONN.P$3 ; also sheet 1
R2: UMBCONN.P$11 ; also sheet 4
R3: UMBCONN.P$8 ; also sheet 4
R4: UMBCONN.P$12 ; also sheet 4
R12: UMBCONN.P$10 ; also sheet 4
R14: UMBCONN.P$9 ; also sheet 4
RESETN: UMBCONN.P$1 ; also sheet 1
SCL: UMBCONN.P$5
SDA: UMBCONN.P$4
SHDN_N: UMBCONN.P$7 ; also sheet 5,8
UMB_ENABLE: R36.2 UMBCONN.P$14 ; also sheet 4,5,8

### Notes on the sheet
- Umbilical Connector
- Programming | Charging
- Programming | Charging
- Programming | Umbilical Enable
- I2C | Radio
- I2C | Radio
- IR Gate | Radio
- LED SHDN | Radio
- Radio | Radio

## Library data of the parts
1N4148 = CNTRL_BOARD:1N4148WS
100T = CNTRL_BOARD:TRIMPOT-TC33
63001 63002 = CNTRL_BOARD:TPS6300X; OC_NEWARK: unknown
BAL_1_BUF BAL_2_BUF LED_EN_BUF RAD_SHDN_BUF RX_BUF TX_BUF = CNTRL_BOARD:SN74LVC1G125
BATTCONN = CNTRL_BOARD:HARWIN_27
C1 = CNTRL_BOARD:CAP: Capacitor Standard 0603 ceramic capacitor, and 0.1" leaded capacitor.; MF: AVX CORPORATION; MPN: 08056D475KAT2A; OC_NEWARK: 84K8400
C2-C7 C18 C21 C22 = CNTRL_BOARD:CAP: Capacitor Standard 0603 ceramic capacitor, and 0.1" leaded capacitor.; MPN: 0603YC104JAT2A; OC_NEWARK: 96M1175
C8 C9 = CNTRL_BOARD:CAP: Capacitor Standard 0603 ceramic capacitor, and 0.1" leaded capacitor.; MF: AVX CORPORATION; MPN: 08056D106KAT2A; OC_NEWARK: 84K8398
C10 = CNTRL_BOARD:CAP: Capacitor Standard 0603 ceramic capacitor, and 0.1" leaded capacitor.; MF: AVX CORPORATION; MPN: 08053C224KAT2A; OC_NEWARK: 96K4775
C11 C12 C19 C23 = CNTRL_BOARD:CAP: Capacitor Standard 0603 ceramic capacitor, and 0.1" leaded capacitor.; OC_NEWARK: unknown
C14 = CNTRL_BOARD:CAP: Capacitor Standard 0603 ceramic capacitor, and 0.1" leaded capacitor.; MPN: C1608X5R1A225K080AC; OC_NEWARK: 04X3244
C15 C20 = CNTRL_BOARD:CAP: Capacitor Standard 0603 ceramic capacitor, and 0.1" leaded capacitor.; MPN: EMK107B7474KA-T; OC_NEWARK: 77M8434
C17 = CNTRL_BOARD:CAP: Capacitor Standard 0603 ceramic capacitor, and 0.1" leaded capacitor.
C26 C27 = CNTRL_BOARD:CAP: Capacitor Standard 0603 ceramic capacitor, and 0.1" leaded capacitor.; MF: AVX CORPORATION; MPN: 08051A101J4T4A; OC_NEWARK: 55J5675
C28 = CNTRL_BOARD:CAP: Capacitor Standard 0603 ceramic capacitor, and 0.1" leaded capacitor.; MF: AVX CORPORATION; MPN: 08051A220JAT2A; OC_NEWARK: 96K4769
C29 = CNTRL_BOARD:CAP: Capacitor Standard 0603 ceramic capacitor, and 0.1" leaded capacitor.; MPN: 08055C681KAT2A; OC_NEWARK: 94W2947
CH1-DM CH2-DM PH-DM T-DM = CNTRL_BOARD:SN74CBTLV3251
CNTRLT = CNTRL_BOARD:AD590-TH
CONNSIDE1 CONNSIDE2 CONNSIDE4 CONNSIDE5 = CNTRL_BOARD:HARWIN_06_HOR; OC_NEWARK: unknown
CONNSIDE3 = CNTRL_BOARD:HARWIN_06; OC_NEWARK: unknown
DRIVECONN = CNTRL_BOARD:HARWIN_27_HOR
IR_NMOS = CNTRL_BOARD:AON7522E
IR_PMOS = CNTRL_BOARD:POWERPMOS; OC_NEWARK: unknown
L1 = rcl:R-EU_: RESISTOR, European symbol; MPN: BLM21PG221SN1D; OC_NEWARK: 73M9167
L2 L4 = resistor:L-US: INDUCTOR, American symbol; OC_NEWARK: unknown
L3 = resistor:L-US: INDUCTOR, American symbol; MPN: JMK212BJ335KG-T; OC_NEWARK: 08P5148
LTC3112 = CNTRL_BOARD:LTC3112; MPN: LTC3112EFE#PBF; OC_NEWARK: 24T2752
MAG = CNTRL_BOARD:HMC5883L; MPN: HMC5883L-TR; OC_NEWARK: 20T0699
MRAM = mram:MR25H10CDC; OC_NEWARK: unknown
PH_AMP_1 PH_AMP_2 T_AMP = CNTRL_BOARD:LT6015
PROGCONN = CNTRL_BOARD:HARWIN_ARCHER_10_SMD
PWR_ON RET SEND = CNTRL_BOARD:LT-T673-Q1R2-25-Z; OC_NEWARK: unknown
R1 R2 = CNTRL_BOARD:RESISTOR; MPN: SR1-0805-222; OC_NEWARK: 33C6600
R3 = CNTRL_BOARD:RESISTOR; MPN: MC01W08051560K; OC_NEWARK: 94W6326
R4 R6 R8-R10 = CNTRL_BOARD:RESISTOR; OC_NEWARK: unknown
R5 R11-R38 R40 = CNTRL_BOARD:RESISTOR
R7 = CNTRL_BOARD:RESISTOR; MPN: ERJ-6GEYJ184V; OC_NEWARK: 53W4944
RADCONNM = CNTRL_BOARD:HARWIN_10; OC_NEWARK: unknown
SAMD21J = SAMD21J_Easy:SAMD21J; OC_NEWARK: unknown
TD-DM = CNTRL_BOARD:SN74CBTLV3253
UMBCONN = CNTRL_BOARD:HARWIN_16

## Net classes
0 default: width 0.254 mm, drill 0.203 mm, clearance 0.203 mm
1 GND: width 0.508 mm, drill 0.254 mm, clearance 0.305 mm
2 3V3: width 0.508 mm, drill 0.254 mm, clearance 0.305 mm
3 3V6: width 1.016 mm, drill 0.254 mm, clearance 0.305 mm
4 5V: width 0.508 mm, drill 0.254 mm, clearance 0.305 mm
5 VIN: width 1.27 mm, drill 0.254 mm, clearance 0.305 mm